# Altium project PCB_Slave_Traffic_Light.PrjPcb (part 4 of 4)
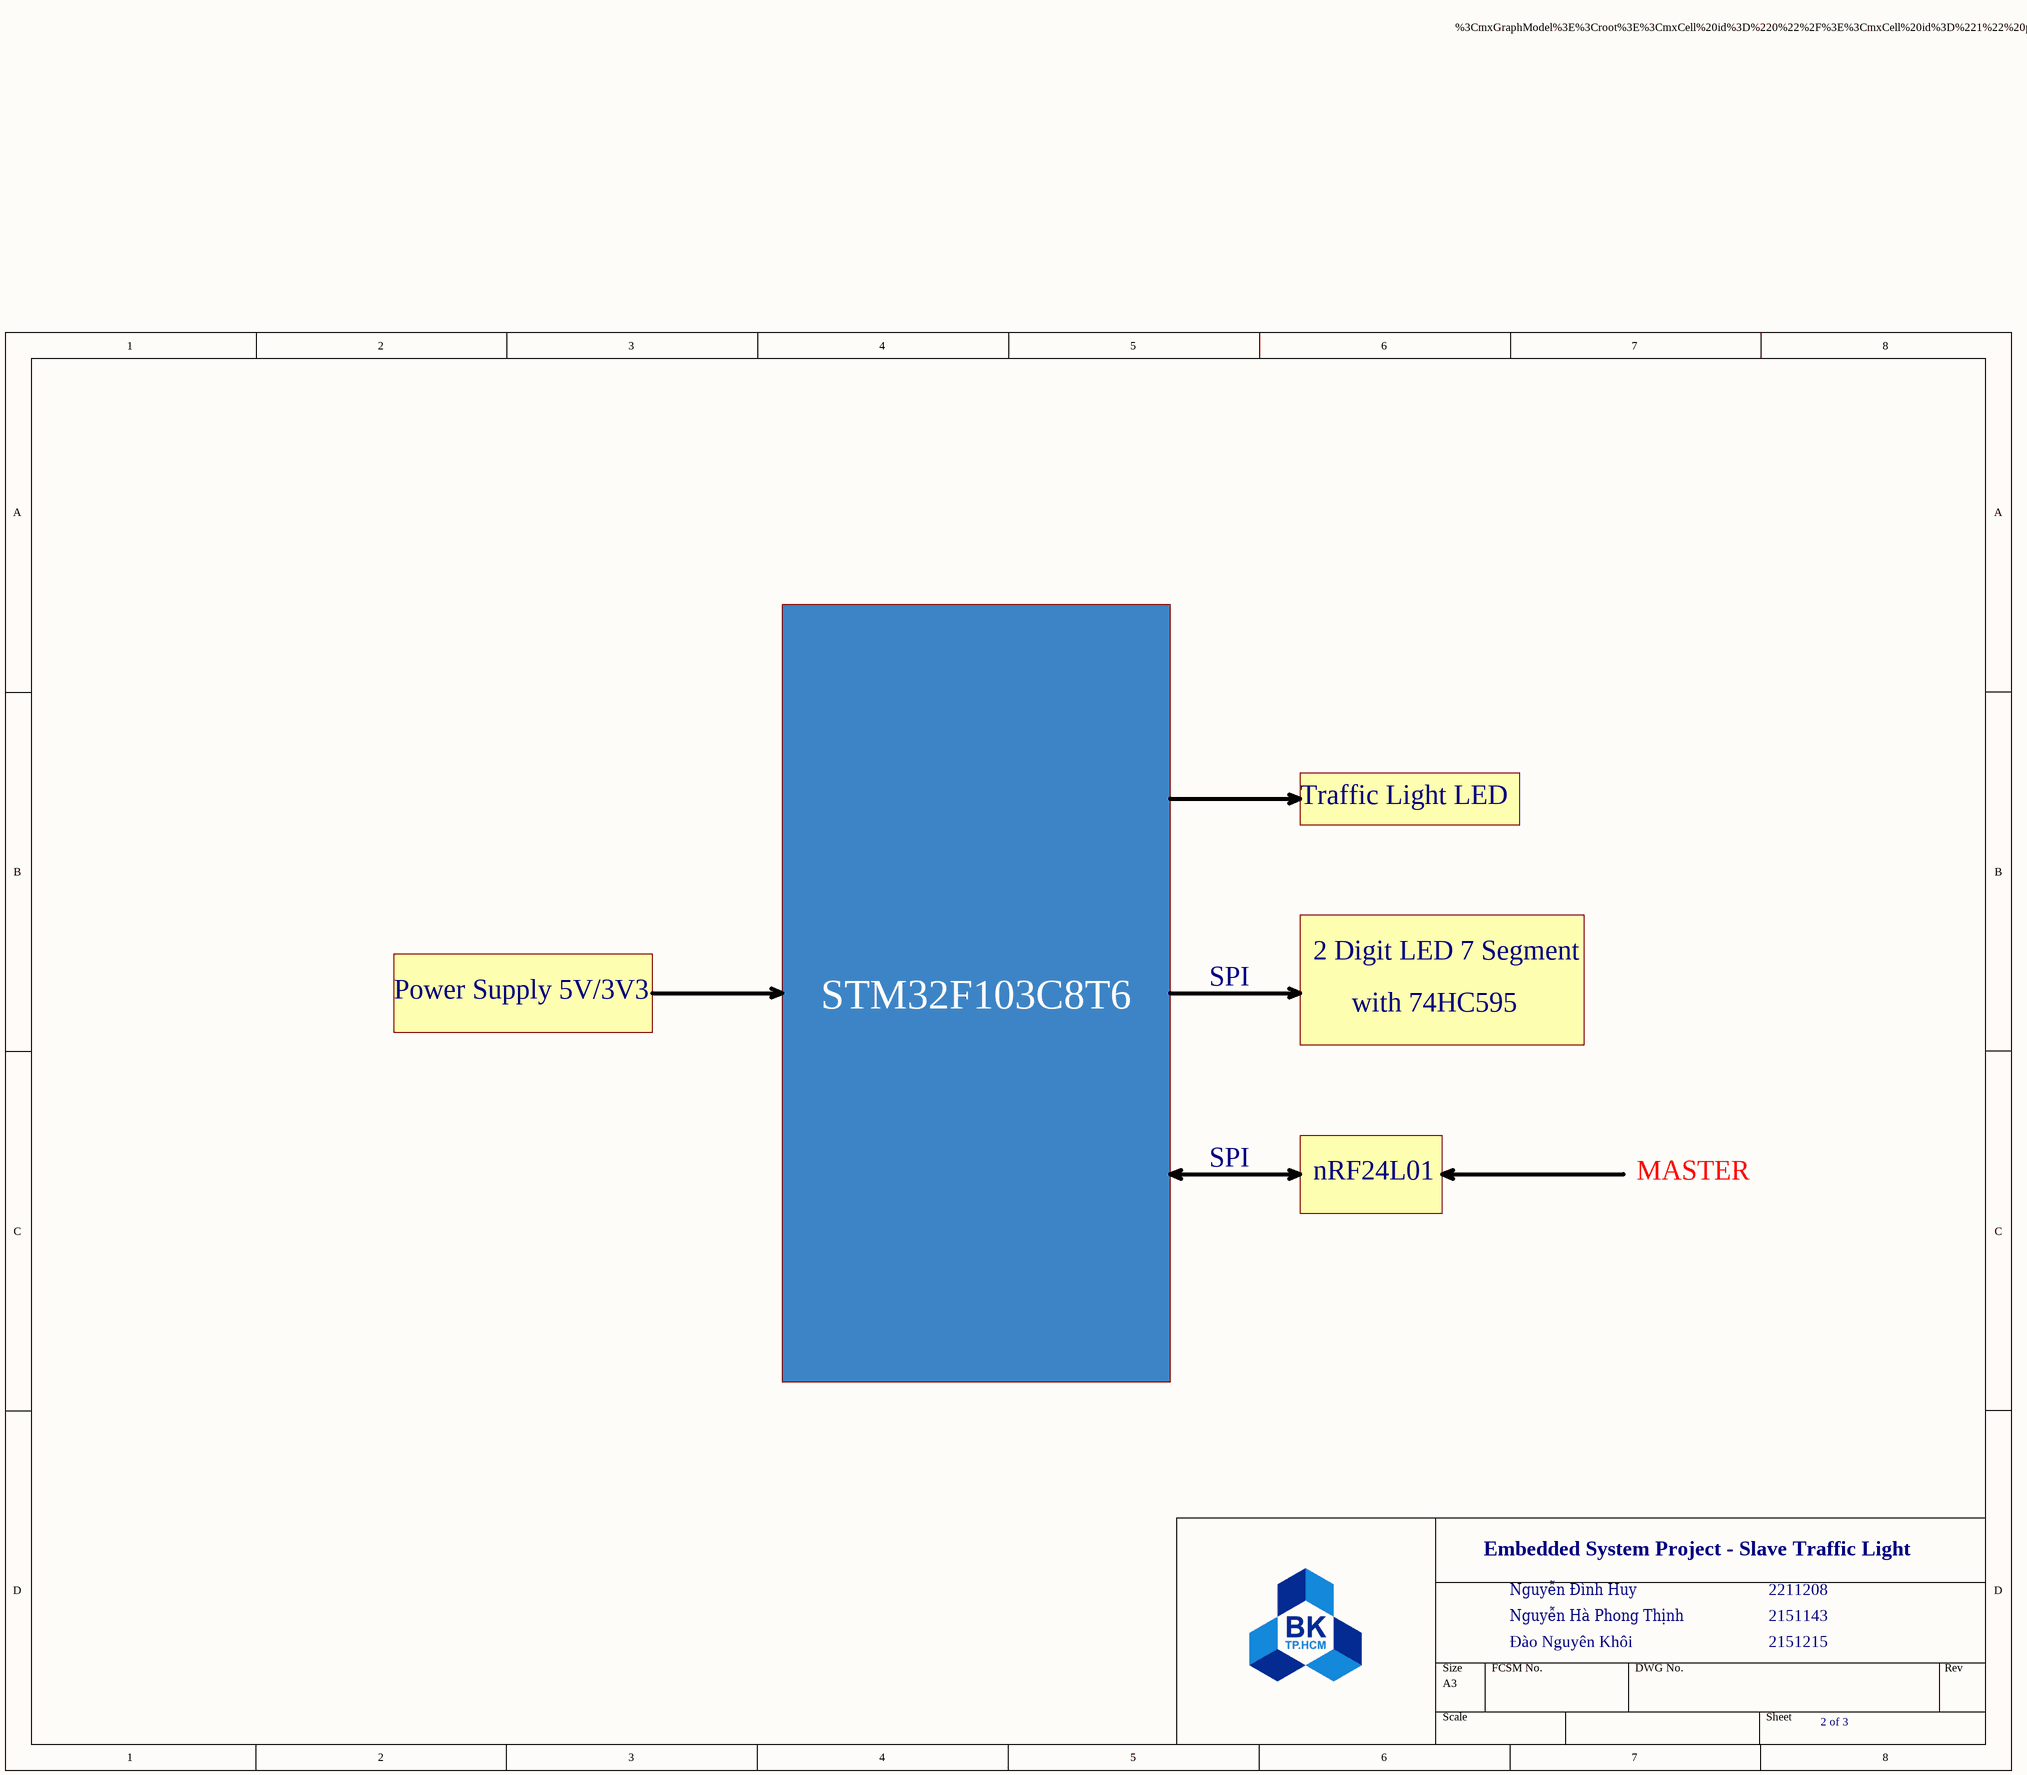
[diagram p5: PCB_Slave_Traffic_Light_BLOCK_DIAGRAM.SchDoc]

## Sheet PCB_Slave_Traffic_Light_BLOCK_DIAGRAM.SchDoc (continued)

### Notes on the sheet (continued)
le%3BwhiteSpace%3Dwrap%3Brounded%3D0%3B%22%20vertex%3D%221%22%20parent%3D%221%22%3E%3CmxGeometry%20x%3D%221120%22%20y%3D%221549.71%22%20width%3D%2232.72%22%20height%3D%2213.92%22%20as%3D%22geometry%22%2F%3E%3C%2FmxCell%3E%3CmxCell%20id%3D%22222%22%20value%3D%22%22%20style%3D%22endArrow%3Dnone%3Bhtml%3D1%3Brounded%3D0%3BentryX%3D-0.003%3BentryY%3D0.145%3BentryDx%3D0%3BentryDy%3D0%3BentryPerimeter%3D0%3B%22%20edge%3D%221%22%20parent%3D%221%22%3E%3CmxGeometry%20width%3D%2250%22%20height%3D%2250%22%20relative%3D%221%22%20as%3D%22geometry%22%3E%3CmxPoint%20x%3D%221104.3999999999999%22%20y%3D%221565.0900000000001%22%20as%3D%22sourcePoint%22%2F%3E%3CmxPoint%20x%3D%221141.2799999999997%22%20y%3D%221564.96%22%20as%3D%22targetPoint%22%2F%3E%3C%2FmxGeometry%3E%3C%2FmxCell%3E%3CmxCell%20id%3D%22223%22%20value%3D%22%22%20style%3D%22endArrow%3Dnone%3Bhtml%3D1%3Brounded%3D0%3B%22%20edge%3D%221%22%20parent%3D%221%22%3E%3CmxGeometry%20width%3D%2250%22%20height%3D%2250%22%20relative%3D%221%22%20as%3D%22geometry%22%3E%3CmxPoint%20x%3D%22840.0000000000001%22%20y%3D%221598.13%22%20as%3D%22sourcePoint%22%2F%3E%3CmxPoint%20x%3D%22840.0000000000001%22%20y%3D%221578.13%22%20as%3D%22targetPoint%22%2F%3E%3C%2FmxGeometry%3E%3C%2FmxCell%3E%3CmxCell%20id%3D%22224%22%20value%3D%22%22%20style%3D%22endArrow%3Dnone%3Bhtml%3D1%3Brounded%3D0%3B%22%20edge%3D%221%22%20parent%3D%221%22%3E%3CmxGeometry%20width%3D%2250%22%20height%3D%2250%22%20relative%3D%221%22%20as%3D%22geometry%22%3E%3CmxPoint%20x%3D%22812.88%22%20y%3D%221598.28%22%20as%3D%22sourcePoint%22%2F%3E%3CmxPoint%20x%3D%22870.0000000000001%22%20y%3D%221598.13%22%20as%3D%22targetPoint%22%2F%3E%3C%2FmxGeometry%3E%3C%2FmxCell%3E%3CmxCell%20id%3D%22225%22%20value%3D%22%22%20style%3D%22endArrow%3Dnone%3Bhtml%3D1%3Brounded%3D0%3B%22%20edge%3D%221%22%20parent%3D%221%22%3E%3CmxGeometry%20width%3D%2250%22%20height%3D%2250%22%20relative%3D%221%22%20as%3D%22geometry%22%3E%3CmxPoint%20x%3D%22820.0000000000001%22%20y%3D%221608.13%22%20as%3D%22sourcePoint%22%2F%3E%3CmxPoint%20x%3D%22860.0000000000001%22%20y%3D%221608.13%22%20as%3D%22targetPoint%22%2F%3E%3C%2FmxGeometry%3E%3C%2FmxCell%3E%3CmxCell%20id%3D%22226%22%20value%3D%22%22%20style%3D%22endArrow%3Dnone%3Bhtml%3D1%3Brounded%3D0%3B%22%20edge%3D%221%22%20parent%3D%221%22%3E%3CmxGeometry%20width%3D%2250%22%20height%3D%2250%22%20relative%3D%221%22%20as%3D%22geometry%22%3E%3CmxPoint%20x%3D%22830.0000000000001%22%20y%3D%221618.13%22%20as%3D%22sourcePoint%22%2F%3E%3CmxPoint%20x%3D%22850.0000000000001%22%20y%3D%221618.13%22%20as%3D%22targetPoint%22%2F%3E%3C%2FmxGeometry%3E%3C%2FmxCell%3E%3CmxCell%20id%3D%22227%22%20value%3D%22%26lt%3Bfont%20style%3D%26quot%3Bfont-size%3A%2010px%3B%26quot%3B%26gt%3BVDD%26lt%3B%2Ffont%26gt%3B%22%20style%3D%22text%3Bhtml%3D1%3Balign%3Dcenter%3BverticalAlign%3Dmiddle%3BwhiteSpace%3Dwrap%3Brounded%3D0%3B%22%20vertex%3D%221%22%20parent%3D%221%22%3E%3CmxGeometry%20x%3D%22950%22%20y%3D%221559.54%22%20width%3D%2220%22%20height%3D%228.92%22%20as%3D%22geometry%22%2F%3E%3C%2FmxCell%3E%3CmxCell%20id%3D%22228%22%20value%3D%22%26lt%3Bfont%20style%3D%26quot%3Bfont-size%3A%2010px%3B%26quot%3B%26gt%3BVDD%26lt%3B%2Ffont%26gt%3B%22%20style%3D%22text%3Bhtml%3D1%3Balign%3Dcenter%3BverticalAlign%3Dmiddle%3BwhiteSpace%3Dwrap%3Brounded%3D0%3B%22%20vertex%3D%221%22%20parent%3D%221%22%3E%3CmxGeometry%20x%3D%221080%22%20y%3D%221562.0900000000001%22%20width%3D%2214.4%22%20height%3D%221.54%22%20as%3D%22geometry%22%2F%3E%3C%2FmxCell%3E%3CmxCell%20id%3D%22229%22%20value%3D%22%26lt%3Bspan%20style%3D%26quot%3Bfont-size%3A%2010px%3B%26quot%3B%26gt%3BGND%26lt%3B%2Fspan%26gt%3B%22%20style%3D%22text%3Bhtml%3D1%3Balign%3Dcenter%3BverticalAlign%3Dmiddle%3BwhiteSpace%3Dwrap%3Brounded%3D0%3B%22%20vertex%3D%221%22%20parent%3D%221%22%3E%3CmxGeometry%20x%3D%221080%22%20y%3D%221572.0900000000001%22%20width%3D%2214.4%22%20height%3D%221.54%22%20as%3D%22geometry%22%2F%3E%3C%2FmxCell%3E%3CmxCell%20id%3D%22230%22%20value%3D%22%26lt%3Bfont%20style%3D%26quot%3Bfont-size%3A%2010px%3B%26quot%3B%26gt%3BSDO%26lt%3B%2Ffont%26gt%3B%22%20style%3D%22text%3Bhtml%3D1%3Balign%3Dcenter%3BverticalAlign%3Dmiddle%3BwhiteSpace%3Dwrap%3Brounded%3D0%3B%22%20vertex%3D%221%22%20parent%3D%221%22%3E%3CmxGeometry%20x%3D%221080%22%20y%3D%221585.96%22%20width%3D%2214.4%22%20height%3D%221.54%22%20as%3D%22geometry%22%2F%3E%3C%2FmxCell%3E%3CmxCell%20id%3D%22231%22%20value%3D%22%26lt%3Bfont%20style%3D%26quot%3Bfont-size%3A%2010px%3B%26quot%3B%26gt%3BSCLK%26lt%3B%2Ffont%26gt%3B%22%20style%3D%22text%3Bhtml%3D1%3Balign%3Dcenter%3BverticalAlign%3Dmiddle%3BwhiteSpace%3Dwrap%3Brounded%3D0%3B%22%20vertex%3D%221%22%20parent%3D%221%22%3E%3CmxGeometry%20x%3D%221080%22%20y%3D%221602.92%22%20width%3D%2214.4%22%20height%3D%221.54%22%20as%3D%22geometry%22%2F%3E%3C%2FmxCell%3E%3CmxCell%20id%3D%22232%22%20value%3D%22%26lt%3Bfont%20style%3D%26quot%3Bfont-size%3A%2010px%3B%26quot%3B%26gt%3BLOAD%26lt%3B%2Ffont%26gt%3B%22%20style%3D%22text%3Bhtml%3D1%3Balign%3Dcenter%3BverticalAlign%3Dmiddle%3BwhiteSpace%3Dwrap%3Brounded%3D0%3B%22%20vertex%3D%221%22%20parent%3D%221%22%3E%3CmxGeometry%20x%3D%221080%22%20y%3D%221622.38%22%20width%3D%2214.4%22%20height%3D%221.54%22%20as%3D%22geometry%22%2F%3E%3C%2FmxCell%3E%3CmxCell%20id%3D%22233%22%20value%3D%22%26lt%3Bfont%20style%3D%26quot%3Bfont-size%3A%2010px%3B%26quot%3B%26gt%3BGND%26lt%3B%2Ffont%26gt%3B%22%20style%3D%22text%3Bhtml%3D1%3Balign%3Dcenter%3BverticalAlign%3Dmiddle%3BwhiteSpace%3Dwrap%3Brounded%3D0%3B%22%20vertex%3D%221%22%20parent%3D%221%22%3E%3CmxGeometry%20x%3D%22952.8%22%20y%3D%221573.3000000000002%22%20width%3D%2214.4%22%20height%3D%221.54%22%20as%3D%22geometry%22%2F%3E%3C%2FmxCell%3E%3CmxCell%20id%3D%22234%22%20value%3D%22%26lt%3Bfont%20style%3D%26quot%3Bfont-size%3A%2010px%3B%26quot%3B%26gt%3BSDI%26lt%3B%2Ffont%26gt%3B%22%20style%3D%22text%3Bhtml%3D1%3Balign%3Dcenter%3BverticalAlign%3Dmiddle%3BwhiteSpace%3Dwrap%3Brounded%3D0%3B%22%20vertex%3D%221%22%20parent%3D%221%22%3E%3CmxGeometry%20x%3D%22952.8%22%20y%3D%221587.17%22%20width%3D%2214.4%22%20height%3D%221.54%22%20as%3D%22geometry%22%2F%3E%3C%2FmxCell%3E%3CmxCell%20id%3D%22235%22%20value%3D%22%26lt%3Bfont%20style%3D%26quot%3Bfont-size%3A%2010px%3B%26quot%3B%26gt%3BSCLK%26lt%3B%2Ffont%26gt%3B%22%20style%3D%22text%3Bhtml%3D1%3Balign%3Dcenter%3BverticalAlign%3Dmiddle%3BwhiteSpace%3Dwrap%3Brounded%3D0%3B%22%20vertex%3D%221%22%20parent%3D%221%22%3E%3CmxGeometry%20x%3D%22952.8%22%20y%3D%221604.13%22%20width%3D%2214.4%22%20height%3D%221.54%22%20as%3D%22geometry%22%2F%3E%3C%2FmxCell%3E%3CmxCell%20id%3D%22236%22%20value%3D%22%26lt%3Bfont%20style%3D%26quot%3Bfont-size%3A%2010px%3B%26quot%3B%26gt%3BLOAD%26lt%3B%2Ffont%26gt%3B%22%20style%3D%22text%3Bhtml%3D1%3Balign%3Dcenter%3BverticalAlign%3Dmiddle%3BwhiteSpace%3Dwrap%3Brounded%3D0%3B%22%20vertex%3D%221%22%20parent%3D%221%22%3E%3CmxGeometry%20x%3D%22952.8%22%20y%3D%221623.5900000000001%22%20width%3D%2214.4%22%20height%3D%221.54%22%20as%3D%22geometry%22%2F%3E%3C%2FmxCell%3E%3CmxCell%20id%3D%22237%22%20value%3D%22PB15%22%20style%3D%22text%3Bhtml%3D1%3Balign%3Dcenter%3BverticalAlign%3Dmiddle%3BwhiteSpace%3Dwrap%3Brounded%3D0%3B%22%20vertex%3D%221%22%20parent%3D%221%22%3E%3CmxGeometry%20x%3D%22901.68%22%20y%3D%221574.84%22%20width%3D%2232.72%22%20height%3D%2213.92%22%20as%3D%22geometry%22%2F%3E%3C%2FmxCell%3E%3CmxCell%20id%3D%22238%22%20value%3D%22%22%20style%3D%22endArrow%3Dnone%3Bhtml%3D1%3Brounded%3D0%3BentryX%3D-0.003%3BentryY%3D0.145%3BentryDx%3D0%3BentryDy%3D0%3BentryPerimeter%3D0%3B%22%20edge%3D%221%22%20parent%3D%221%22%3E%3CmxGeometry%20width%3D%2250%22%20height%3D%2250%22%20relative%3D%221%22%20as%3D%22geometry%22%3E%3CmxPoint%20x%3D%22907.12%22%20y%3D%221589.72%22%20as%3D%22sourcePoint%22%2F%3E%3CmxPoint%20x%3D%22944%22%20y%3D%221589.59%22%20as%3D%22targetPoint%22%2F%3E%3C%2FmxGeometry%3E%3C%2FmxCell%3E%3CmxCell%20id%3D%22239%22%20value%3D%22PB13%22%20style%3D%22text%3Bhtml%3D1%3Balign%3Dcenter%3BverticalAlign%3Dmiddle%3BwhiteSpace%3Dwrap%3Brounded%3D0%3B%22%20vertex%3D%221%22%20parent%3D%221%22%3E%3CmxGeometry%20x%3D%22901.68%22%20y%3D%221591.5%22%20width%3D%2232.72%22%20height%3D%2213.92%22%20as%3D%22geometry%22%2F%3E%3C%2FmxCell%3E%3CmxCell%20id%3D%22240%22%20value%3D%22%22%20style%3D%22endArrow%3Dnone%3Bhtml%3D1%3Brounded%3D0%3BentryX%3D-0.003%3BentryY%3D0.145%3BentryDx%3D0%3BentryDy%3D0%3BentryPerimeter%3D0%3B%22%20edge%3D%221%22%20parent%3D%221%22%3E%3CmxGeometry%20width%3D%2250%22%20height%3D%2250%22%20relative%3D%221%22%20as%3D%22geometry%22%3E%3CmxPoint%20x%3D%22907.52%22%20y%3D%221605.64%22%20as%3D%22sourcePoint%22%2F%3E%3CmxPoint%20x%3D%22944.4%22%20y%3D%221605.51%22%20as%3D%22targetPoint%22%2F%3E%3C%2FmxGeometry%3E%3C%2FmxCell%3E%3CUserObject%20label%3D%22%26lt%3Ba%20href%3D%26quot%3Bhttps%3A%2F%2Fwww.thegioiic.com%2Fmach-den-giao-thong-led-10mm-5vdc%26quot%3B%26gt%3BM%E1%BA%A1ch%20%C4%90%C3%A8n%20Giao%20Th%C3%B4ng%20LED%2010mm%205VDC%20Ngu%E1%BB%93n%3A%205VDC%2C%20LED%2010mm%2C%20d%C3%B9ng%20cho%20Arduino%26lt%3B%2Fa%26gt%3B%22%20link%3D%22%26lt%3Ba%20href%3D%26quot%3Bhttps%3A%2F%2Fwww.thegioiic.com%2Fmach-den-giao-thong-led-10mm-5vdc%26quot%3B%26gt%3BM%E1%BA%A1ch%20%C4%90%C3%A8n%20Giao%20Th%C3%B4ng%20LED%2010mm%205VDC%20Ngu%E1%BB%93n%3A%205VDC%2C%20LED%2010mm%2C%20d%C3%B9ng%20cho%20Arduino%26lt%3B%2Fa%26gt%3B%22%20id%3D%22241%22%3E%3CmxCell%20style%3D%22text%3BwhiteSpace%3Dwrap%3Bhtml%3D1%3B%22%20vertex%3D%221%22%20parent%3D%221%22%3E%3CmxGeometry%20x%3D%22524.5%22%20y%3D%221486%22%20width%3D%22149.5%22%20height%3D%2236%22%20as%3D%22geometry%22%2F%3E%3C%2FmxCell%3E%3C%2FUserObject%3E%3C%2Froot%3E%3C%2FmxGraphModel%3E
- Traffic Light LED
- Power Supply 5V/3V3
- STM32F103C8T6
- SPI
- 2 Digit LED 7 Segment
- with 74HC595
- nRF24L01
- MASTER
- Embedded System Project - Slave Traffic Light
- Nguyễn Đình Huy
- 2211208
- Nguyễn Hà Phong Thịnh
- Đào Nguyên Khôi
- 2151143
- 2151215
- 2 of 3

## Sheet PCB_Slave_Traffic_Light_COVER_PAGE.SchDoc
size A3; SheetNumber: 3; SheetTotal: 3
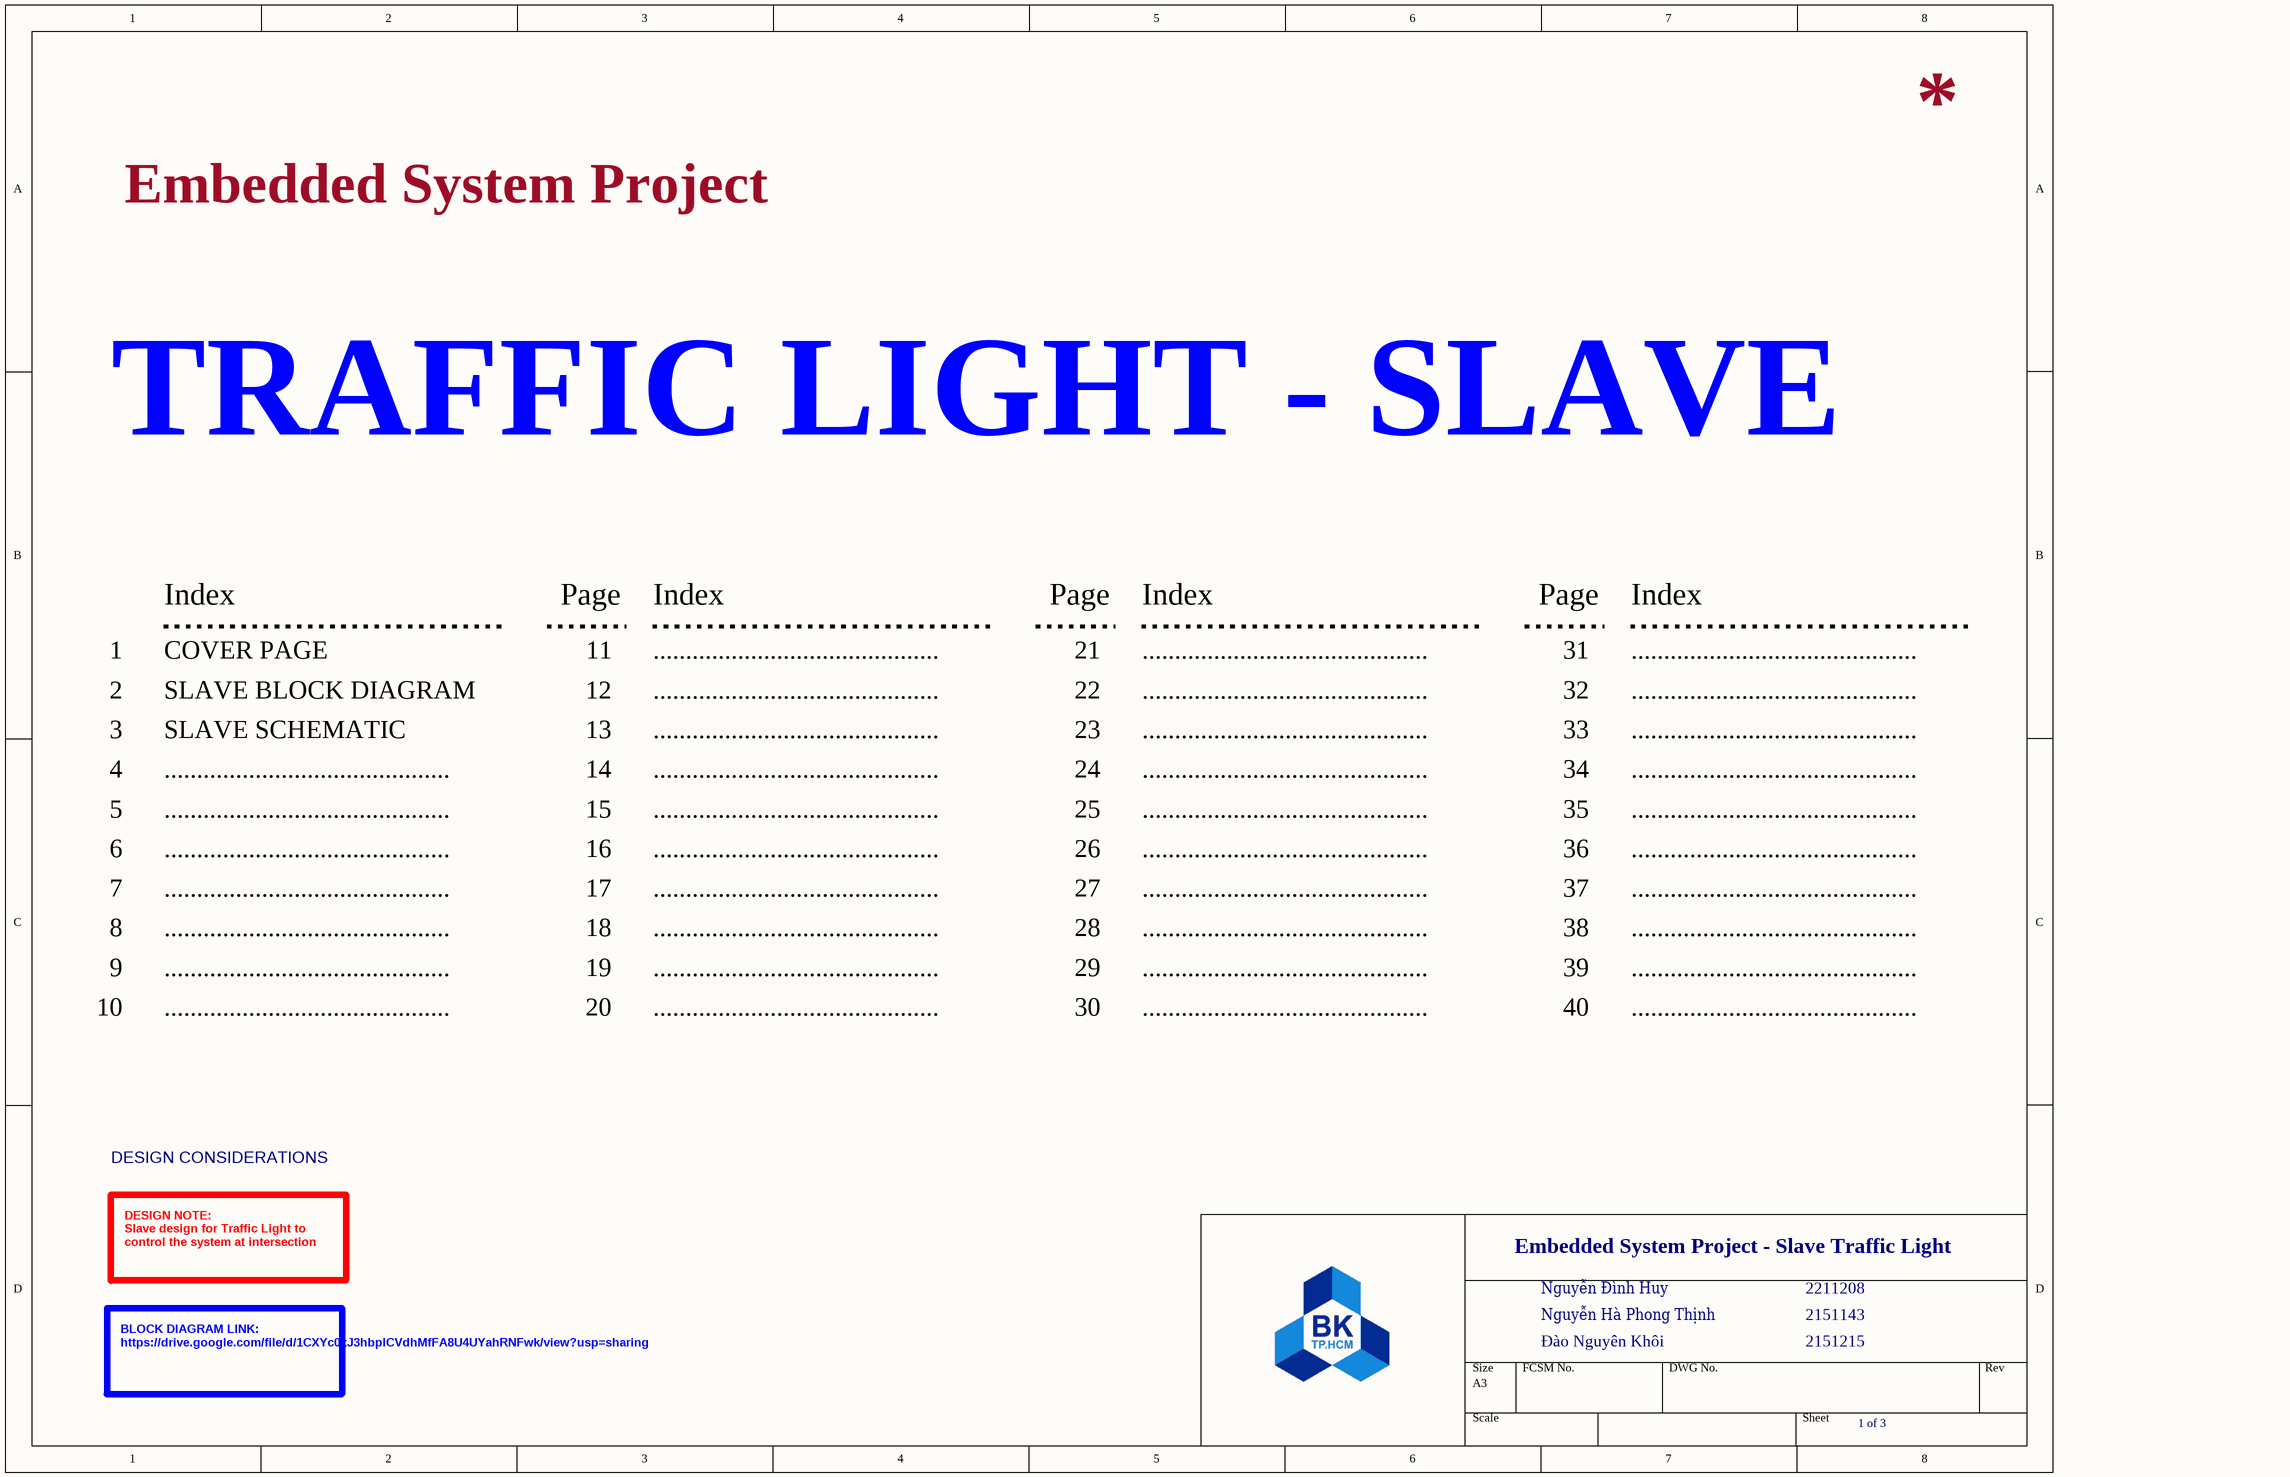
[diagram p2: PCB_Slave_Traffic_Light_COVER_PAGE.SchDoc]

### Notes on the sheet
- Embedded System Project
- TRAFFIC LIGHT - SLAVE
- Index
- Page
- 1
- 2
- COVER PAGE
- SLAVE BLOCK DIAGRAM
- 11
- 12
- ............................................
- 21
- 22
- 31
- 32
- 3
- SLAVE SCHEMATIC
- 13
- 23
- 33
- 4
- 5
- 14
- 15
- 24
- 25
- 34
- 35
- 6
- 7
- 16
- 17
- 26
- 27
- 36
- 37
- 8
- 18
- 28
- 38
- 9
- 10
- 19
- 20
- 29
- 30
- 39
- 40
- DESIGN CONSIDERATIONS
- DESIGN NOTE:
  Slave design for Traffic Light to control the system at intersection
- Embedded System Project - Slave Traffic Light
- Nguyễn Đình Huy
- 2211208
- Nguyễn Hà Phong Thịnh
- Đào Nguyên Khôi
- 2151143
- 2151215
- BLOCK DIAGRAM LINK:
  https://drive.google.com/file/d/1CXYc0xJ3hbplCVdhMfFA8U4UYahRNFwk/view?usp=sharing
- 1 of 3